# EAGLE design MS6205-Arduino (EAGLE 9.6.2)
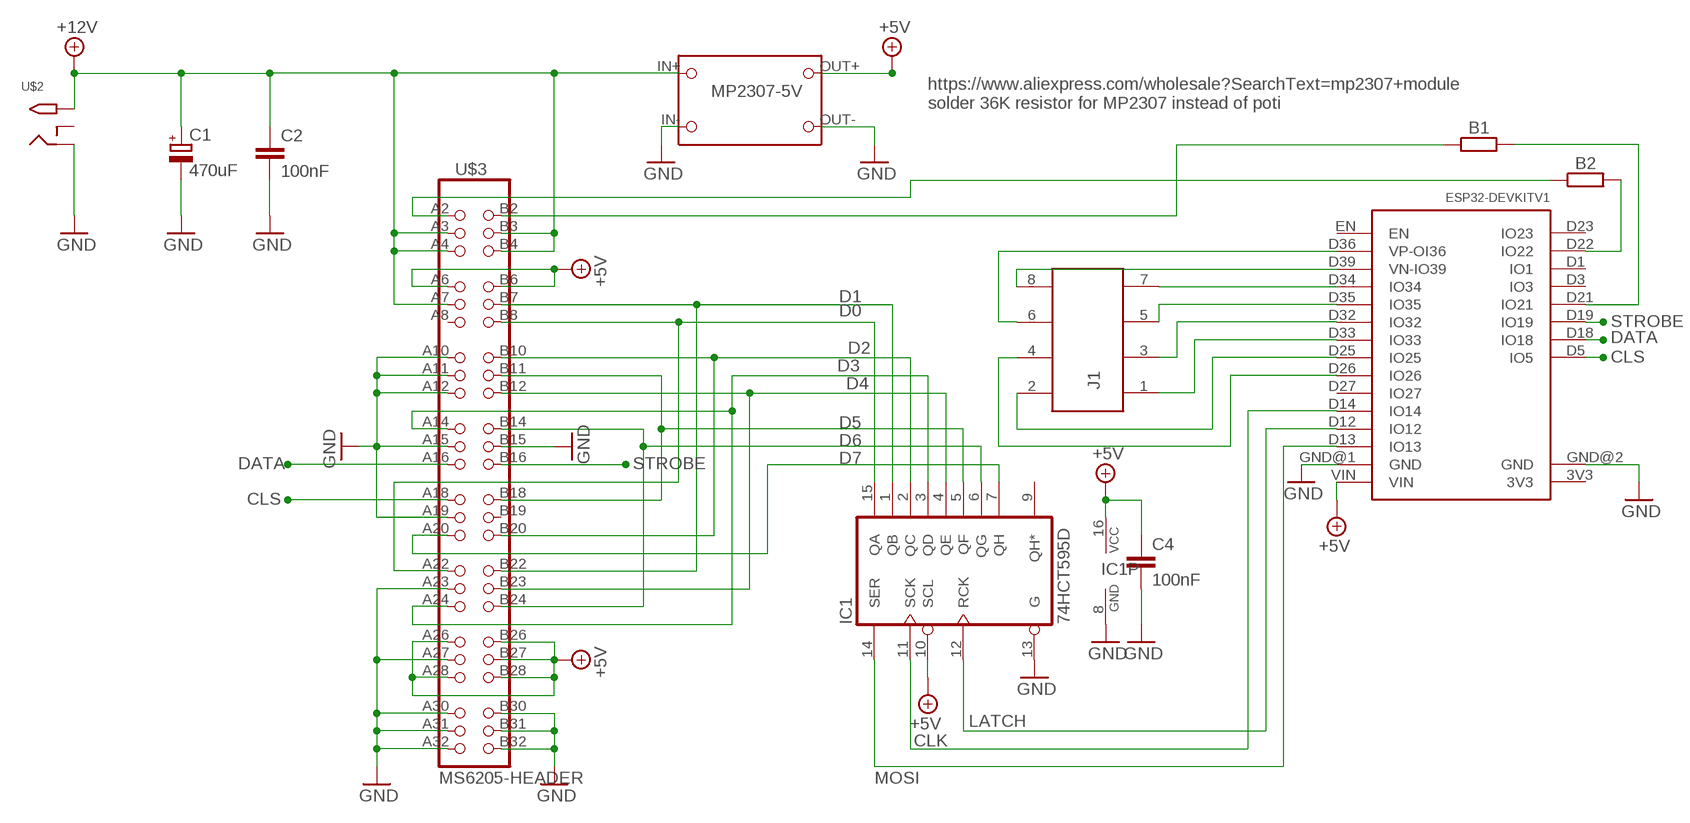
[diagram p0: schematic, sheet 1]

## Parts
B1  0  R-EU_0204/5  [0204/5]
B2  0  R-EU_0204/5  [0204/5]
C1  470uF  CPOL-EU150CLZ-1010  [150CLZ-1010]
C2  100nF  C-EUC1206  [C1206]
C4  100nF  C-EUC0805  [C0805]
IC1  74HCT595D  [SO16]
J1  61200822323  [61200822323]
MP2307-5V  PWS-MP2307  [MP2307-PWS]
U$1  ESP32DEVKIT1-REDUCED  [ESP32-DEVKIT1-REDUCED]
U$2  2.1MMJACKTHM  [PJ-102A]
U$3  MS6205-HEADER  [MS6205_CONNECTOR_HOLE]

## Nets
+12V: C1.+ C2.1 MP2307-5V.IN+ U$2.TIP U$3.A3 U$3.A4 U$3.A7 U$3.B3 U$3.B4
CLK: IC1.11(SCK) U$1.D14(IO14)
CLS: U$1.D5(IO5) U$3.A18
D0: IC1.15(QA) U$3.A22 U$3.B8
D1: IC1.1(QB) U$3.B7 U$3.B22
D2: IC1.2(QC) U$3.B10 U$3.B20
D3: IC1.3(QD) U$3.A14 U$3.A24
D4: IC1.4(QE) U$3.B12 U$3.B23
D5: IC1.5(QF) U$3.B11 U$3.B18
D6: IC1.6(QG) U$3.B14 U$3.B24
D7: IC1.7(QH) U$3.A20
DATA: U$1.D18(IO18) U$3.A16
GND: C1.- C2.2 C4.2 IC1.8(GND) IC1.13(G) MP2307-5V.IN- MP2307-5V.OUT- U$1.GND@1(GND) U$1.GND@2(GND) U$2.RING U$3.A10 U$3.A11 U$3.A12 U$3.A15 U$3.A19 U$3.A23 U$3.A27 U$3.A30 U$3.A31 U$3.A32 U$3.B15 U$3.B30 U$3.B31 U$3.B32
LATCH: IC1.12(RCK) U$1.D12(IO12)
MOSI: IC1.14(SER) U$1.D13(IO13)
N$1: B1.1 U$3.B2
N$2: B2.1 U$3.A2
N$3: B1.2 U$1.D21(IO21)
N$4: B2.2 U$1.D22(IO22)
N$5: J1.2 U$1.D25(IO25)
N$6: J1.1 U$1.D33(IO33)
N$7: J1.4 U$1.D26(IO26)
N$8: J1.3 U$1.D32(IO32)
N$9: J1.5 U$1.D35(IO35)
N$10: J1.7 U$1.D34(IO34)
N$11: J1.8 U$1.D39(VN-IO39)
N$12: J1.6 U$1.D36(VP-OI36)
STROBE: U$1.D19(IO19) U$3.B16
VCC: C4.1 IC1.10(SCL) IC1.16(VCC) MP2307-5V.OUT+ U$1.VIN U$3.A6 U$3.A26 U$3.A28 U$3.B6 U$3.B26 U$3.B27 U$3.B28 ; supply symbol labelled +5V
Unconnected: IC1.9(QH*) U$1.3V3 U$1.D1(IO1) U$1.D3(IO3) U$1.D23(IO23) U$1.D27(IO27) U$1.EN U$2.RING_SW U$3.A8 U$3.B19

## Notes on the sheet
- https://www.aliexpress.com/wholesale?SearchText=mp2307+module
  solder 36K resistor for MP2307 instead of poti

## Library data of the parts
B1 B2 = rcl:R-EU_: RESISTOR, European symbol; SPICEPREFIX: R
C1 = rcl:CPOL-EU: POLARIZED CAPACITOR, European symbol; SPICEPREFIX: C
C2 C4 = rcl:C-EU: CAPACITOR, European symbol; SPICEPREFIX: C
IC1 = 74xx-eu:74*595: 8-bit SHIFT REGISTER, output latch
J1 = Wurth_Elektronik_Electromechanic_Wire_to_Board_Connectors_rev19a:61200822323: WR-BHD 2.54mm Board to Cable Transition Connector, 8 Pins=>Code : Con_WTB_IDC_61200822323 <http://katalog.we-online.de/media/thumbs2/eican/thb_Con_WTB_IDC_6120xx22323_pf2.jpg> Details see: http://katalog.we-online.de/en/em/612_0xx_223_23 Created 2014-06-05, Karrer Zheng 2014 (C) Würth Elektronik
MP2307-5V = MS6205_Display:PWS-MP2307
U$1 = ESP32-DEVKITV1:ESP32DEVKIT1-REDUCED; SPICEPREFIX: X
U$2 = adafruit:2.1MMJACK: 2.1mm x 5.5mm THM DC jack with internal switch. Digikey part #PJ-102A, 4UCON part #05537 2.1mm x 5.5mm SMT DC jack with internal switch. Digikey part #PJ-002A-SMT, 4UCON part #03267 By microbuilder.eu & adafruit.com
U$3 = MS6205_Display:MS6205-HEADER

## Board
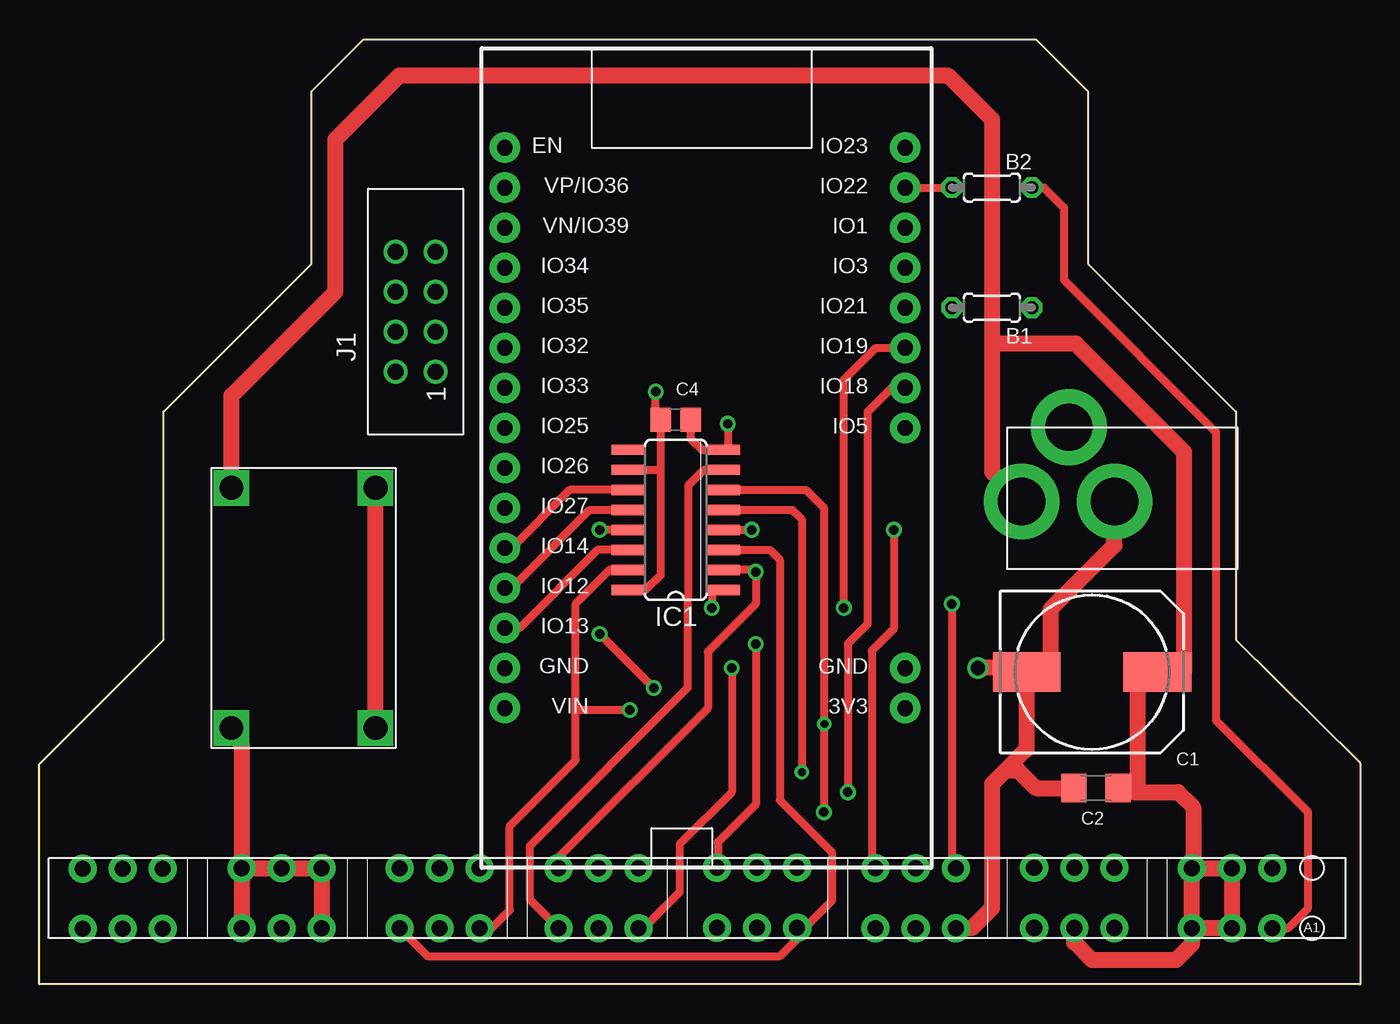
[diagram p1: board, top side]
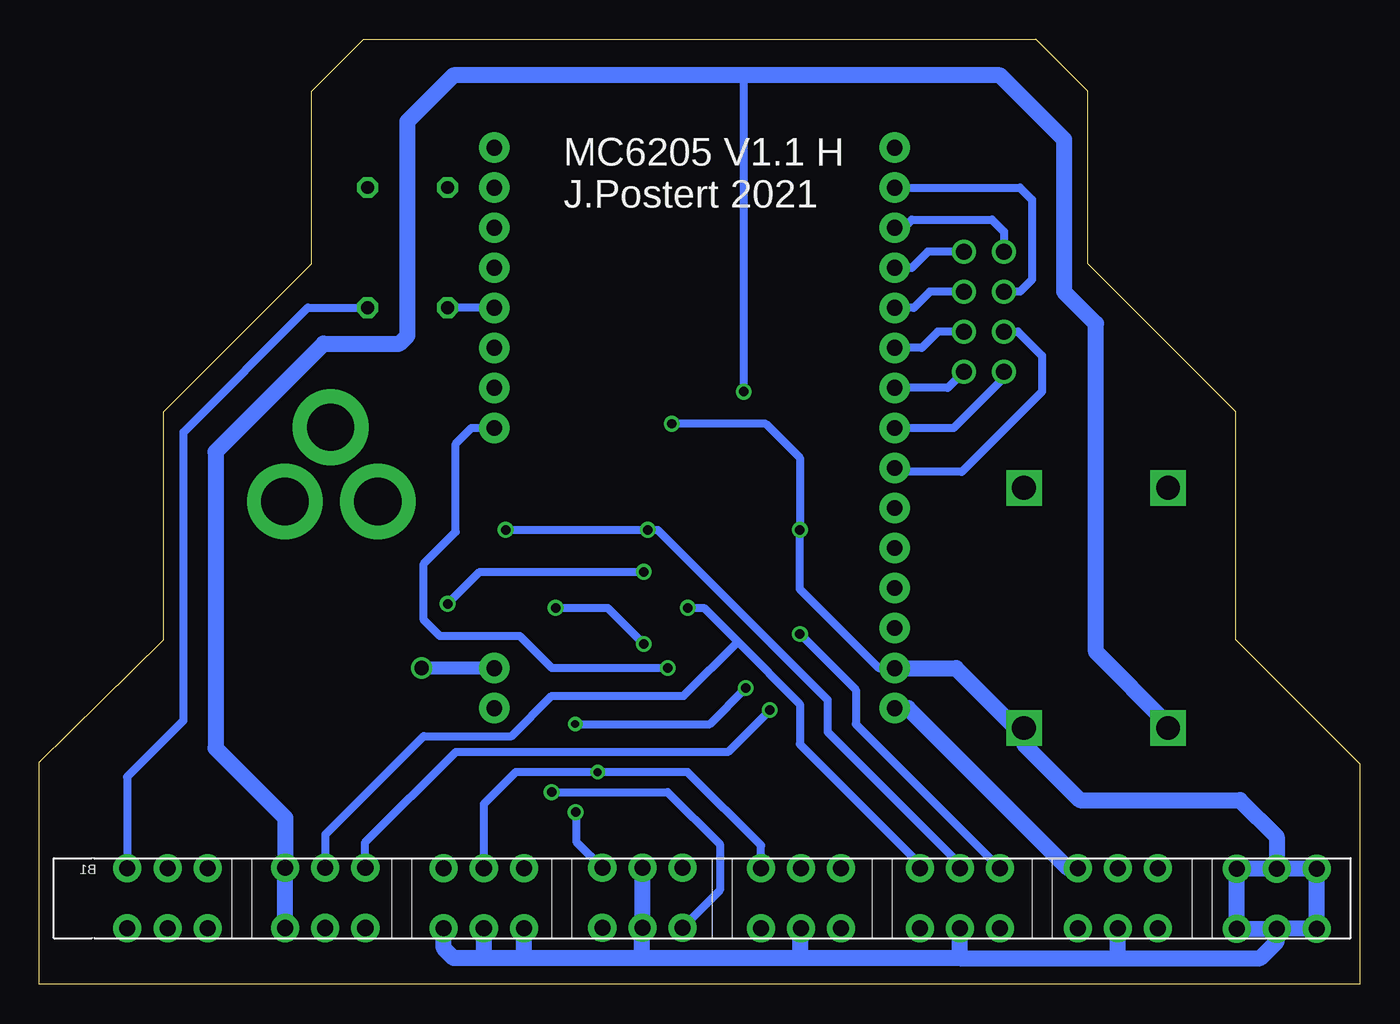
[diagram p2: board, bottom side, seen from below]

Size 83.82 x 59.94 mm. Coordinates in mm from the lower left corner, seen from the top.
Outline: 0,13.97 7.87,21.84 7.87,36.32 17.27,45.72 17.27,56.64 20.57,59.94 63.25,59.94 66.55,56.64 66.55,45.72 75.95,36.32 75.95,21.84 83.82,14.1 83.82,0 0,0 0,13.97
Copper layers (1*16): Top 0.035mm / dielectric 1.5mm / Bottom 0.035mm
Design rules "default *": minimum track width 6mil, minimum drill 0.35mm, track to track 6mil, track to pad 6mil, pad to pad 6mil, via to via 6mil, smd to smd 6mil, copper to edge 40mil, drill to drill 6mil, minimum pad ring 10mil, minimum via ring 8mil, stop-mask expansion 4mil, vias tented up to drill 0mil, thermal gap 10mil

### Footprints (pad centres in the part's own frame; a part is rotated, then mirrored left to right if it is on the bottom)
0204/5 = drill 0.813 octagon: 1 -2.54,0; 2 2.54,0
150CLZ-1010 = smd 4.3 x 2.5: + 4.15,0; - -4.15,0
C1206 = smd 1.6 x 1.8: 1 -1.4,0; 2 1.4,0
C0805 = smd 1.3 x 1.5: 1 -0.95,0; 2 0.95,0
SO16 = smd 0.66 x 2.032: 1 -4.445,-3.073; 2 -3.175,-3.073; 3 -1.905,-3.073; 4 -0.635,-3.073; 5 0.635,-3.073; 6 1.905,-3.073; 7 3.175,-3.073; 8 4.445,-3.073; 9 4.445,3.073; 10 3.175,3.073; 11 1.905,3.073; 12 0.635,3.073; 13 -0.635,3.073; 14 -1.905,3.073; 15 -3.175,3.073; 16 -4.445,3.073
61200822323 = drill 1.02: 1 -2.54,-1.27; 2 -2.54,1.27; 3 0,-1.27; 4 0,1.27; 5 2.54,-1.27; 6 2.54,1.27; 7 5.08,-1.27; 8 5.08,1.27
MP2307-PWS = drill 1.5 square: IN+ -7.62,-3.81; IN- -7.62,5.334; OUT+ 7.62,-3.81; OUT- 7.62,5.334
ESP32-DEVKIT1-REDUCED = drill 1 pad 1.93: 3V3 -15.25,-12.27; D1 15.23,-12.27; D3 12.69,-12.27; D5 2.53,-12.27; D12 -7.63,13.135; D13 -10.17,13.135; D14 -5.09,13.135; D18 5.07,-12.27; D19 7.61,-12.27; D21 10.15,-12.27; D22 17.77,-12.27; D23 20.31,-12.27; D25 2.53,13.135; D26 -0.01,13.135; D27 -2.55,13.135; D32 7.61,13.135; D33 5.07,13.135; D34 12.69,13.135; D35 10.15,13.135; D36 17.77,13.135; D39 15.23,13.135; EN 20.31,13.135; GND@1 -12.71,13.135; GND@2 -12.71,-12.27; VIN -15.25,13.135
PJ-102A = drill 3 pad 4.8: RING 0.1,-3.39; RING_SW -4.6,-6.29; TIP 0.1,-9.29
MS6205_CONNECTOR_HOLE = drill 1.016 pad 1.778: A2 -38.1,0; A3 -35.56,0; A4 -33.02,0; A6 -28.08,-0.013; A7 -25.54,-0.013; A8 -23,-0.013; A10 -18.021,0; A11 -15.481,0; A12 -12.941,0; A14 -7.963,-0.038; A15 -5.423,-0.038; A16 -2.883,-0.038; A18 2.108,0; A19 4.648,0; A20 7.188,0; A22 12.192,0.013; A23 14.732,0.013; A24 17.272,0.013; A26 22.225,0; A27 24.765,0; A28 27.305,0; A30 32.296,0.038; A31 34.836,0.038; A32 37.376,0.038; B2 -38.1,-3.81; B3 -35.56,-3.81; B4 -33.02,-3.81; B6 -28.08,-3.823; B7 -25.54,-3.823; B8 -23,-3.823; B10 -18.021,-3.81; B11 -15.481,-3.81; B12 -12.941,-3.81; B14 -7.963,-3.848; B15 -5.423,-3.848; B16 -2.883,-3.848; B18 2.108,-3.81; B19 4.648,-3.81; B20 7.188,-3.81; B22 12.192,-3.797; B23 14.732,-3.797; B24 17.272,-3.797; B26 22.225,-3.81; B27 24.765,-3.81; B28 27.305,-3.81; B30 32.296,-3.772; B31 34.836,-3.772; B32 37.376,-3.772

### Placement (x,y rotation side)
B1  60.45,42.93 180 top
B2  60.45,50.55 180 top
C1  66.8,19.81 0 top
C2  67.06,12.45 180 top
C4  40.39,35.81 0 top
IC1  40.39,29.46 90 top
J1  23.88,41.4 90 top
MP2307-5V  16,23.88 270 top
U$1  42.67,32.77 90 top
U$2  71.63,30.73 270 top
U$3  40.13,3.56 180 top

### Tracks (layer width: path | path; a pad name or v marks a point on that pad's centre or on a via)
+12V
  Top 1.016: 60.45,40.64 65.79,40.64 72.64,33.78 72.64,19.81 C1.+ 69.67,19.81 69.67,12.45 | 60.45,40.64 60.45,54.86 57.66,57.66 22.86,57.66 18.8,53.59 18.8,43.94 12.19,37.34 MP2307-5V.IN+ | 60.45,40.64 60.45,32.52 U$2.TIP | U$3.A4 U$3.A3 U$3.B3 U$3.B4 | U$3.B4 73.23,7.44 73.23,11.23 72.26,12.19 69.42,12.19 69.67,12.45 | U$3.A4 U$3.B4 | U$3.A4 73.15,2.54 72.14,1.52 66.8,1.52 65.67,2.65 U$3.A7 | C2.1 69.67,12.45
CLK
  Top 0.508: IC1.11 33.65,31.37 29.96,27.68 U$1.D14
CLS  (via drill 0.6)
  Top 0.508: v43.94,20.07 43.94,12.19 40.64,8.89 40.64,5.84 38.35,3.56 U$3.A18
  Bottom 0.508: v43.94,20.07 51.31,20.07 53.34,22.1 58.42,22.1 59.44,23.11 59.44,26.67 57.4,28.7 57.4,34.29 56.4,35.3 U$1.D5
D0  (via drill 0.6)
  Top 0.508: IC1.15 36.2,26.29 34.04,24.13 34.04,17.4 | 34.04,17.4 34.04,14.22 29.85,10.03 29.85,4.7 28.69,3.54 U$3.A22 | v37.46,17.4 34.04,17.4
  Bottom 0.508: v37.46,17.4 40.13,14.73 57.4,14.73 63.17,8.97 63.17,7.42 U$3.B8
D1  (via drill 0.6)
  Top 0.508: IC1.1 42.67,25.02 v42.67,23.88
  Bottom 0.508: v42.67,23.88 41.66,23.88 39.5,21.72 | 39.5,21.72 35.56,17.78 35.56,15.24 27.94,7.62 U$3.B22 | 39.5,21.72 42.93,18.29 51.31,18.29 53.85,15.75 59.44,15.75 65.68,9.5 65.68,7.39 U$3.B7
D2  (via drill 0.6)
  Top 0.508: IC1.2 45.34,26.29 v45.47,26.16 45.47,24.13 42.42,21.08 42.42,17.53 32.94,8.05 U$3.B20 | U$3.B10 57.91,7.61 v57.91,24.13
  Bottom 0.508: v45.47,26.16 55.88,26.16 v57.91,24.13
D3
  Top 0.508: IC1.3 46.35,27.56 46.99,26.92 46.99,11.68 50.29,8.38 50.29,5.28 48.6,3.59 U$3.A14 48.13,3.56 48.13,2.92 46.99,1.78 24.62,1.78 U$3.A24
D4  (via drill 0.6)
  Top 0.508: IC1.4 v45.21,28.83 | v54.23,28.83 54.23,22.55 52.83,21.16 52.83,7.61 U$3.B12
  Bottom 0.508: v54.23,28.83 v45.21,28.83 44.58,28.83 33.78,18.03 33.78,16 25.4,7.62 U$3.B23
D5  (via drill 0.5)
  Top 0.508: IC1.5 47.78,30.1 48.39,29.49 v48.39,13.46
  Bottom 0.508: U$3.B11 55.63,7.38 55.63,11.43 53.59,13.46 v48.39,13.46 42.67,13.46 38.02,8.81 U$3.B18
D6  (via drill 0.5, 0.6)
  Top 0.508: IC1.6 48.64,31.37 49.78,30.23 49.78,16.51 | 49.78,16.51 v49.81,16.51 | v38.99,18.8 v35.56,22.23 | 49.78,16.51 v49.78,10.92
  Bottom 0.508: v49.81,16.51 41.27,16.51 v38.99,18.8 | v35.56,22.23 32,18.67 32,16.51 22.86,7.37 U$3.B24 | U$3.B14 49.75,9.05 49.75,10.88 v49.78,10.92
D7
  Top 0.508: IC1.7 42.19,32.64 41.17,31.62 41.17,24.66 41.15,24.64 41.15,18.8 31.12,8.76 31.12,5.38 U$3.A20
DATA  (via drill 0.6)
  Top 0.508: v51.31,12.19 51.31,21.59 52.58,22.86 52.58,36.32 54.1,37.85 54.93,37.85 U$1.D18
  Bottom 0.508: U$3.A16 40.64,5.97 40.64,8.89 43.94,12.19 v51.31,12.19
GND  (via drill 0.6, 0.9)
  Top 0.508: C4.2 41.34,34.61 42.04,33.91 IC1.8 43.69,34.14 v43.69,35.56 | IC1.13 v35.56,28.83
  Top 1.016: v59.56,20.07 62.4,20.07 C1.- | U$2.RING 68.24,27.84 64.18,23.78 64.18,20.57 63.41,19.81 C1.- | MP2307-5V.OUT- MP2307-5V.IN- | C1.- 62.65,14.9 61.34,13.59 | 61.34,13.59 60.45,12.7 60.45,4.83 59.18,3.56 U$3.A10 | 61.34,13.59 62.1,13.59 63.25,12.45 C2.2
  Bottom 0.508: U$1.GND@1 29.72,20.06 30.55,20.06 35.56,25.06 v35.56,28.83 35.56,33.4 37.72,35.56 v43.69,35.56
  Bottom 0.813: U$1.GND@2 59.55,20.06 v59.56,20.07
  Bottom 1.016: 29.72,20.06 25.64,20.06 21.84,16.26 MP2307-5V.OUT- 21.34,15.24 17.78,11.68 7.62,11.68 5.3,9.36 U$3.B31 | U$3.B31 U$3.B32 U$3.A32 U$3.A31 | U$3.B31 U$3.B30 U$3.A30 U$3.A31 | 25.4,1.65 15.37,1.65 | 15.37,1.65 6.35,1.65 5.3,2.71 U$3.A31 | 25.4,1.65 U$3.A23 | U$3.A10 58.17,3.54 58.17,2.29 57.53,1.65 55.63,1.65 | 25.4,1.65 35.56,1.65 | 35.56,1.65 45.59,1.65 | 45.59,1.65 53.09,1.65 | 53.09,1.65 55.63,1.65 | U$3.A12 53.09,3.54 53.09,1.65 | U$3.A11 55.63,3.54 55.63,1.65 | U$3.A19 35.56,3.48 35.56,1.65 | 45.59,1.65 45.59,3.56 U$3.A15 U$3.B15 | 15.37,1.65 U$3.A27
LATCH
  Top 0.508: U$1.D12 29.96,25.14 34.92,30.1 IC1.12
MOSI
  Top 0.508: IC1.14 35.43,27.56 30.47,22.6 U$1.D13
N$1
  Bottom 0.508: B1.1 66.78,42.93 74.68,35.03 74.68,16.75 78.26,13.16 78.26,7.39 U$3.B2
N$2
  Top 0.508: B2.1 63.75,50.55 65.02,49.28 65.02,44.69 74.68,35.03 74.68,16.76 80.52,10.92 80.52,4.83 79.25,3.56 U$3.A2
N$3
  Bottom 0.508: U$1.D21 B1.2
N$4
  Top 0.508: U$1.D22 B2.2
N$5
  Bottom 0.508: U$1.D25 25.79,35.3 22.61,38.48 J1.2
N$6
  Bottom 0.508: J1.1 26.17,37.84 U$1.D33
N$7
  Bottom 0.508: J1.4 21.72,41.4 20.19,39.88 20.19,37.59 25.27,32.51 29.29,32.51 U$1.D26
N$8
  Bottom 0.508: J1.3 26.8,41.4 27.82,40.38 U$1.D32
N$9
  Bottom 0.508: J1.5 27.3,43.94 28.33,42.92 U$1.D35
N$10
  Bottom 0.508: U$1.D34 28.46,45.46 27.43,46.48 J1.7
N$11
  Bottom 0.508: U$1.D39 28.97,48 28.45,48.51 23.37,48.51 22.61,47.75 J1.8
N$12
  Bottom 0.508: U$1.D36 21.58,50.54 20.83,49.78 20.83,44.7 21.59,43.94 J1.6
STROBE  (via drill 0.6)
  Top 0.508: v51.05,23.88 51.05,38.35 53.08,40.38 U$1.D19 | U$3.B16 43.05,7.44 43.05,9.02 45.47,11.43 v45.47,21.59
  Bottom 0.508: v51.05,23.88 47.75,23.88 v45.47,21.59
VCC  (via drill 0.6)
  Top 0.508: IC1.10 39.24,32.64 39.44,32.83 | 39.44,32.83 39.44,25.97 38.48,25.02 IC1.16 | 39.44,32.83 C4.1 39.12,36.13 v39.12,37.59
  Top 1.016: MP2307-5V.OUT+ 12.19,15.88 12.83,15.24 U$3.B28 | U$3.B28 U$3.A28 | U$3.A26 U$3.B26 U$3.B27 U$3.B28
  Bottom 0.508: v39.12,37.59 39.12,57.66
  Bottom 1.016: U$1.VIN 28.69,17.52 18.54,7.37 U$3.B26 | MP2307-5V.OUT+ 12.19,16.51 16.76,21.08 16.76,41.91 18.8,43.94 18.8,53.59 22.86,57.66 39.12,57.66 57.53,57.66 60.45,54.74 60.45,41.15 60.96,40.64 65.79,40.64 72.64,33.78 72.64,14.99 68.21,10.55 U$3.B6 U$3.A6

### Text on the board
bPlace: MC6205 V1.1 H / J.Postert 2021
bTestmark: MS6205 Display / V1.0 JPostert 2021